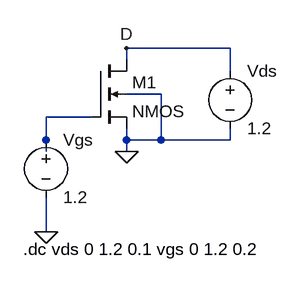
[diagram p0: schematic 90nm_NMOS.asc]
90nm_NMOS.asc, the LTspice schematic file:
Version 4
SHEET 1 880 680
WIRE 240 -16 96 -16
WIRE 96 0 96 -16
WIRE 240 16 240 -16
WIRE 144 48 96 48
WIRE 48 80 -16 80
WIRE -16 112 -16 80
WIRE 96 112 96 96
WIRE 144 112 144 48
WIRE 144 112 96 112
WIRE 240 112 240 96
WIRE 240 112 144 112
WIRE -16 128 -16 112
WIRE 96 128 96 112
WIRE -16 240 -16 192
FLAG 96 128 0
FLAG -16 240 0
FLAG 96 -16 D
SYMBOL nmos4 48 0 R0
SYMATTR InstName M1
SYMATTR Value2 l=90nm w=135nm
SYMBOL voltage 240 0 R0
WINDOW 123 0 0 Left 0
WINDOW 39 0 0 Left 0
SYMATTR InstName Vds
SYMATTR Value 1.2
SYMBOL voltage -16 96 R0
WINDOW 123 0 0 Left 0
WINDOW 39 0 0 Left 0
SYMATTR InstName Vgs
SYMATTR Value 1.2
TEXT -48 264 Left 2 !.dc vds 0 1.2 0.1 vgs 0 1.2 0.2

The netlist it stands for:
* 90nm_NMOS.asc
M1 D N001 0 0 NMOS l=90nm w=135nm
Vds D 0 1.2
Vgs N001 0 1.2
.model NMOS NMOS
.model PMOS PMOS
.lib standard.mos
.dc vds 0 1.2 0.1 vgs 0 1.2 0.2
.backanno
.end